# EAGLE schematic schematic (EAGLE 9.7.0)
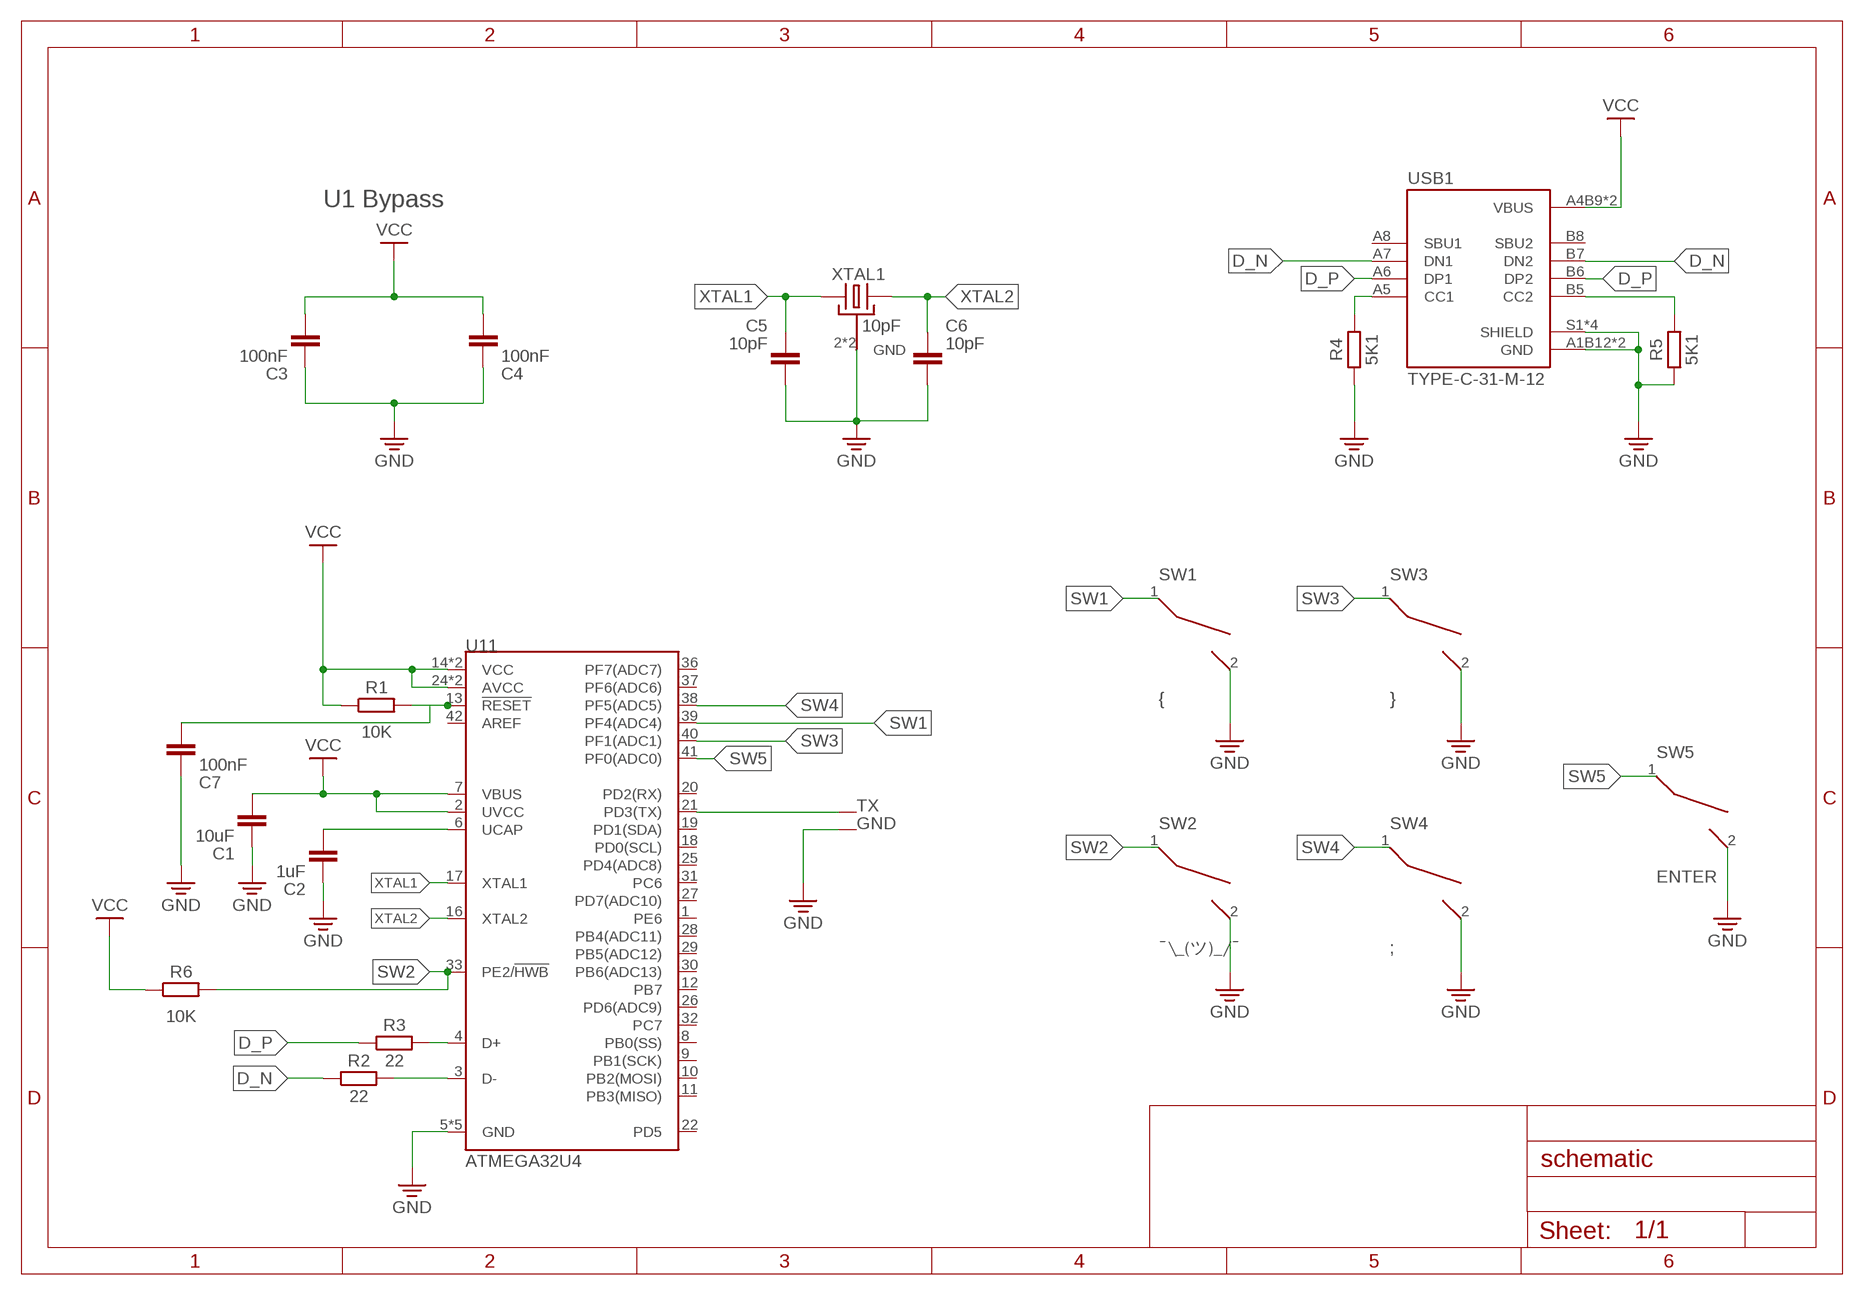
[diagram p0: schematic, sheet 1]

## Parts
C1  10uF  C_CHIP-0805(2012-METRIC)  [CAPC2012X110]
C2  1uF  C_CHIP-0805(2012-METRIC)  [CAPC2012X110]
C3  100nF  C_CHIP-0805(2012-METRIC)  [CAPC2012X110]
C4  100nF  C_CHIP-0805(2012-METRIC)  [CAPC2012X110]
C5  10pF  C_CHIP-0805(2012-METRIC)  [CAPC2012X110]
C6  10pF  C_CHIP-0805(2012-METRIC)  [CAPC2012X110]
C7  100nF  C_CHIP-0805(2012-METRIC)  [CAPC2012X110]
R1  10K  R_CHIP-0805(2012-METRIC)  [RESC2012X65]
R2  22  R_CHIP-0805(2012-METRIC)  [RESC2012X65]
R3  22  R_CHIP-0805(2012-METRIC)  [RESC2012X65]
R4  5K1  R_CHIP-0805(2012-METRIC)  [RESC2012X65]
R5  5K1  R_CHIP-0805(2012-METRIC)  [RESC2012X65]
R6  10K  R_CHIP-0805(2012-METRIC)  [RESC2012X65]
SW1  {  MX_HOTSWAP  [SWITCH_SOCKET]
SW2  ¯\_(ツ)_/¯  MX_HOTSWAP  [SWITCH_SOCKET]
SW3  }  MX_HOTSWAP  [SWITCH_SOCKET]
SW4  ;  MX_HOTSWAP  [SWITCH_SOCKET]
SW5  ENTER  MX_HOTSWAP  [SWITCH_SOCKET]
TP1  TX  TP  [TP]
TP2  GND  TP  [TP]
U11  ATMEGA32U4  [ATMEGA32U4-TQFP44]
USB1  TYPE-C-31-M-12  [TYPE-C-31-M-12]
XTAL1  10pF  XTAL-GND  [OSCCC320X250X69N]

## Nets
D_N: R2.1 USB1.A7(DN1) USB1.B7(DN2)
D_P: R3.1 USB1.A6(DP1) USB1.B6(DP2)
GND: C1.1 C2.1 C3.1 C4.1 C5.2 C6.2 C7.1 R4.1 R5.1 SW1.2 SW2.2 SW3.2 SW4.2 SW5.2 TP2.P$1(P) U11.5(GND) U11.15(GND) U11.23(GND) U11.35(GND) U11.43(GND) USB1.A1B12(GND) USB1.B1A12(GND) USB1.S1(SHIELD) USB1.S2(SHIELD) USB1.S3(SHIELD) USB1.S4(SHIELD) XTAL1.2(GND) XTAL1.4(GND)
N$1: C7.2 R1.2 U11.13(!RESET)
N$3: C2.2 U11.6(UCAP)
N$4: R2.2 U11.3(D-)
N$5: R3.2 U11.4(D+)
N$6: R4.2 USB1.A5(CC1)
N$7: R5.2 USB1.B5(CC2)
N$8: TP1.P$1(P) U11.21(PD3(TX))
SW1: SW1.1 U11.39(PF4(ADC4))
SW2: R6.2 SW2.1 U11.33(PE2/!HWB)
SW3: SW3.1 U11.40(PF1(ADC1))
SW4: SW4.1 U11.38(PF5(ADC5))
SW5: SW5.1 U11.41(PF0(ADC0))
VCC: C1.2 C3.2 C4.2 R1.1 R6.1 U11.2(UVCC) U11.7(VBUS) U11.14(VCC) U11.24(AVCC) U11.34(VCC) U11.44(AVCC) USB1.A4B9(VBUS) USB1.B4A9(VBUS)
XTAL1: C5.1 U11.17(XTAL1) XTAL1.1
XTAL2: C6.1 U11.16(XTAL2) XTAL1.3
Unconnected: U11.1(PE6) U11.8(PB0(SS)) U11.9(PB1(SCK)) U11.10(PB2(MOSI)) U11.11(PB3(MISO)) U11.12(PB7) U11.18(PD0(SCL)) U11.19(PD1(SDA)) U11.20(PD2(RX)) U11.22(PD5) U11.25(PD4(ADC8)) U11.26(PD6(ADC9)) U11.27(PD7(ADC10)) U11.28(PB4(ADC11)) U11.29(PB5(ADC12)) U11.30(PB6(ADC13)) U11.31(PC6) U11.32(PC7) U11.36(PF7(ADC7)) U11.37(PF6(ADC6)) U11.42(AREF) USB1.A8(SBU1) USB1.B8(SBU2)

## Notes on the sheet
- U1 Bypass

## Library data of the parts
C1-C7 = Capacitor:C: Capacitor - Generic; CATEGORY: Capacitor
R1-R6 = Resistor:R: Resistor Fixed - Generic; CATEGORY: Resistor; SUB-CATEGORY: Fixed
SW1-SW5 = keyboard:MX_HOTSWAP
TP1 TP2 = _GMLib:TP
U11 = _GMLib:ATMEGA32U4: Datasheet: https://datasheet.lcsc.com/lcsc/2304140030_Microchip-Tech-ATMEGA32U4-AU_C44854.pdf
USB1 = _GMLib:TYPE-C-31-M-12: USB-C Connector Datasheet <https://datasheet.lcsc.com/lcsc/2108131730_Korean-Hroparts-Elec-TYPE-C-31-M-12_C165948.pdf>
XTAL1 = _GMLib:XTAL-GND